# EAGLE design mapleCUx_med_024 (EAGLE 7.3.0)
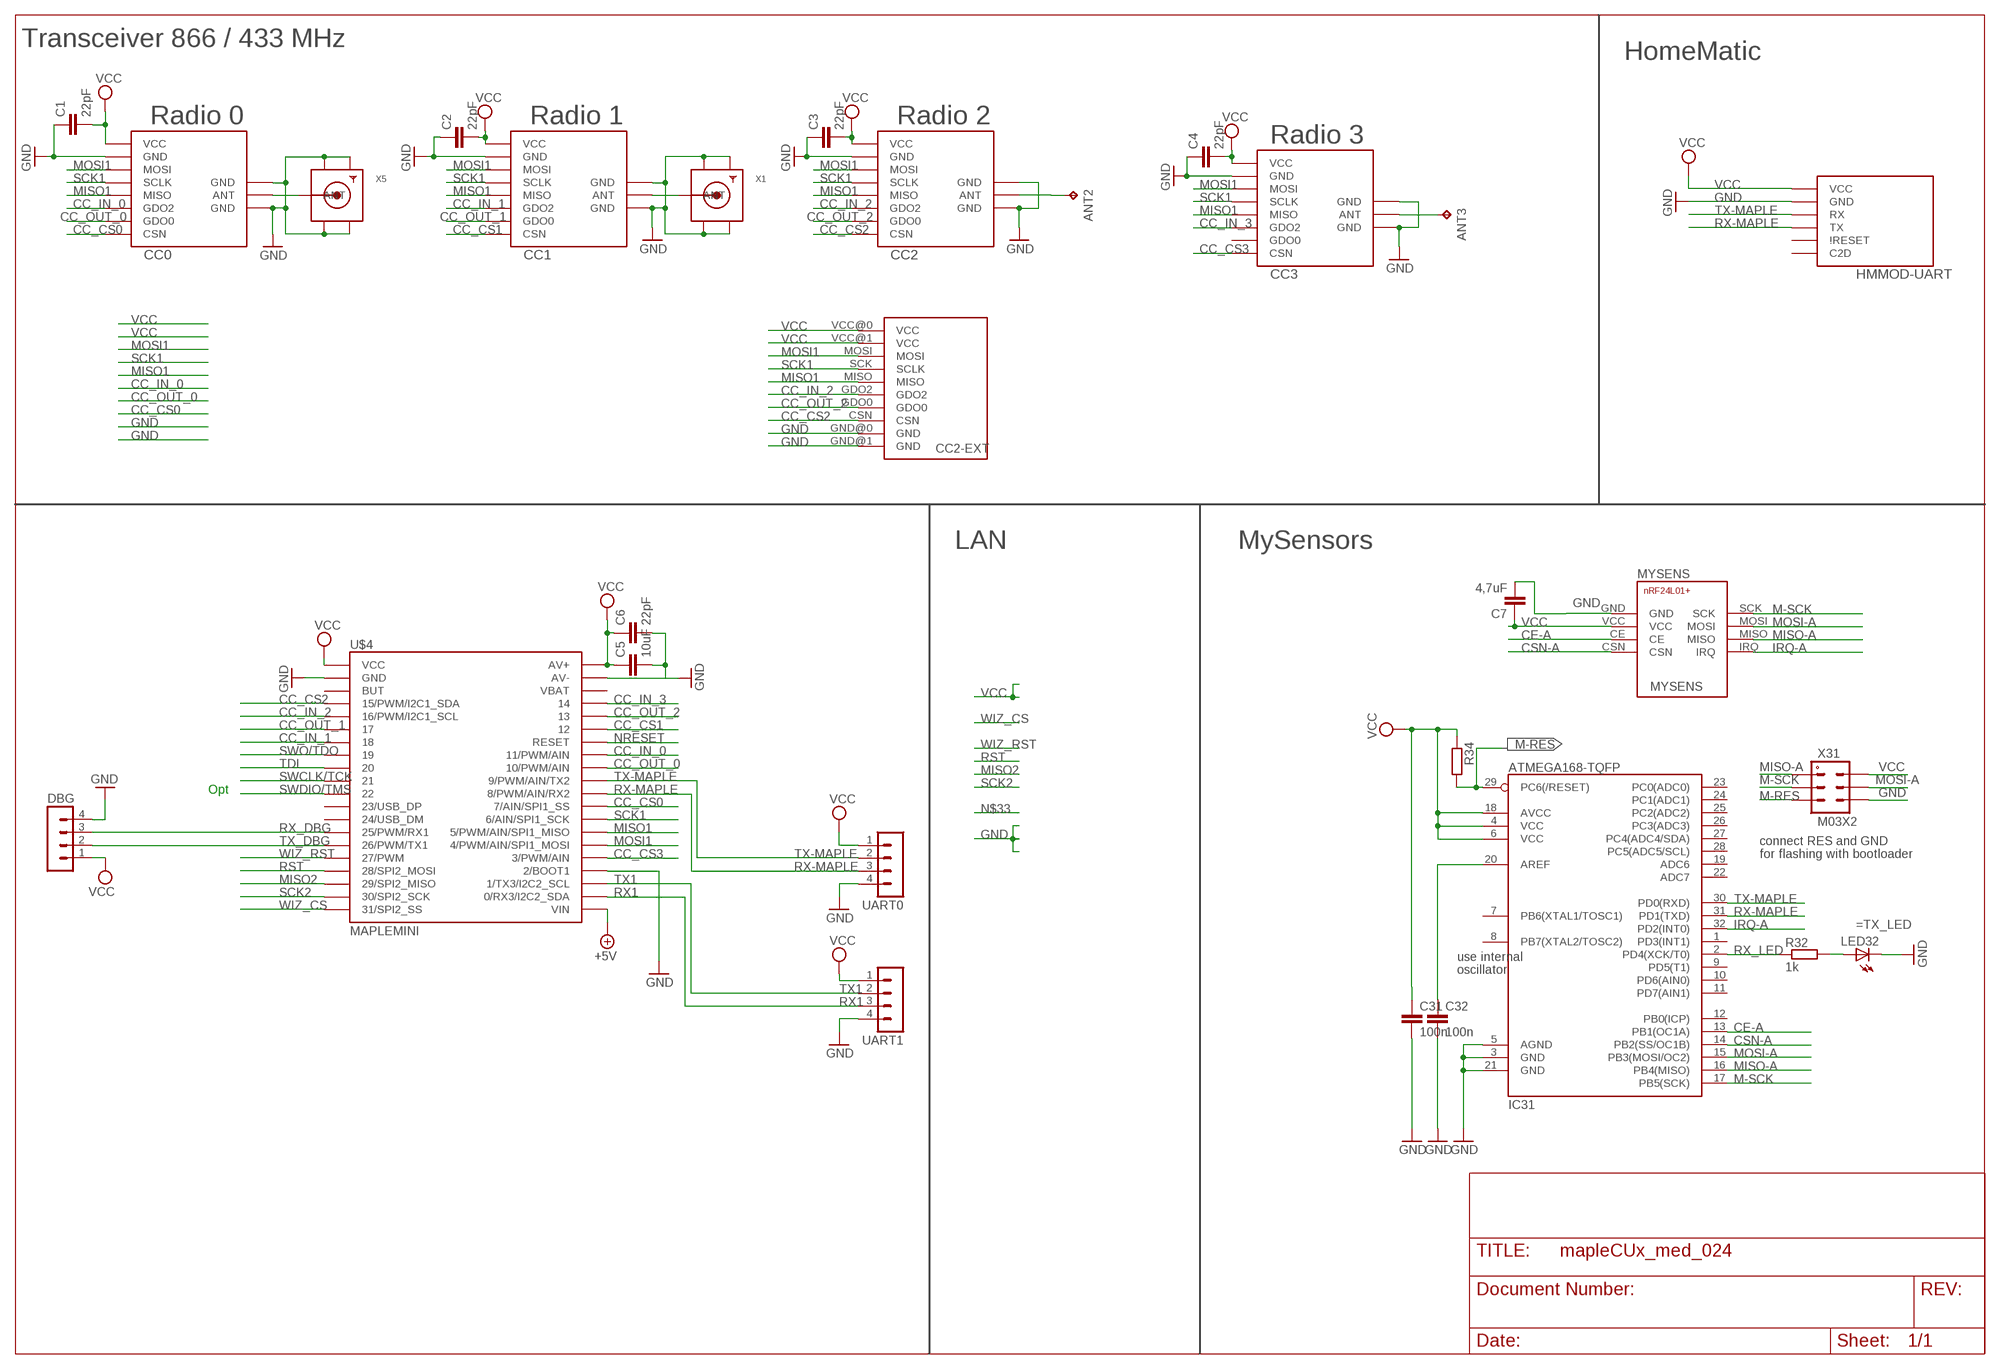
[diagram p0: schematic, sheet 1]

## Parts
ANT2  TPPAD1-13  [P1-13]
ANT3  TPPAD1-13  [P1-13]
C1  22pF  C-EUC0805  [C0805]
C2  22pF  C-EUC0805  [C0805]
C3  22pF  C-EUC0805  [C0805]
C4  22pF  C-EUC0805  [C0805]
C5  10uF  C-EUC1210  [C1210]
C6  22pF  C-EUC0805  [C0805]
C7  4,7uF  C-EUC1210  [C1210]
C31  100n  C-EUC0805  [C0805]
C32  100n  C-EUC0805  [C0805]
CC0  CC1101  CC1101_MODULE1SMD  [CC1101_MODULE1_SMD]
CC1  CC1101_MODULE1SMD  [CC1101_MODULE1_SMD]
CC2  CC1101_MODULE1SMD  [CC1101_MODULE1_SMD]
CC2-EXT  CC1101_MODULE3_DIL  [CC1101_MODULE3_DIL]
CC3  CC1101_MODULE1SMD  [CC1101_MODULE1_SMD]
DBG  MA04-1  [MA04-1]
HMMOD-UART  HM-MOD-UARTDIL  [HM-MOD-UART-DIL]
IC31  ATMEGA168-TQFP  [TQFP32-08]
LED32  LEDCHIPLED_0805  [CHIPLED_0805]
MYSENS  NRF24L01+SMD  [NRF24L01+SMD]
R32  1k  R-EU_R0805  [R0805]
R34  R-EU_R0805  [R0805]
U$4  MAPLEMINI  [20-DIP]
UART0  MA04-1  [MA04-1]
UART1  MA04-1  [MA04-1]
X1  SMACONNECTOR_EDGE_UFL  [SMA_EDGELAUNCH_UFL]
X5  SMACONNECTOR_EDGE_UFL  [SMA_EDGELAUNCH_UFL]
X31  M03X2  [2X03-1.27MM_SMD]

## Nets
+5V: U$4.21(VIN)
CC_CS0: CC0.CSN U$4.29(7/AIN/SPI1_SS)
CC_CS1: CC1.CSN U$4.35
CC_CS2: CC2-EXT.CSN CC2.CSN U$4.4(15/PWM/I2C1_SDA)
CC_CS3: CC3.CSN U$4.25(3/PWM/AIN)
CC_IN_0: CC0.GDO2 U$4.33(11/PWM/AIN)
CC_IN_1: CC1.GDO2 U$4.7
CC_IN_2: CC2-EXT.GDO2 CC2.GDO2 U$4.5(16/PWM/I2C1_SCL)
CC_IN_3: CC3.GDO2 U$4.37
CC_OUT_0: CC0.GDO0 U$4.32(10/PWM/AIN)
CC_OUT_1: CC1.GDO0 U$4.6
CC_OUT_2: CC2-EXT.GDO0 CC2.GDO0 U$4.36
CE-A: IC31.13(PB1(OC1A)) MYSENS.CE
CSN-A: IC31.14(PB2(SS/OC1B)) MYSENS.CSN
GND [PWR]: C1.1 C2.1 C3.1 C4.1 C5.2 C6.2 C7.2 C31.2 C32.2 CC0.GND@0(GND) CC0.GND@1(GND) CC0.GND@2(GND) CC1.GND@0(GND) CC1.GND@1(GND) CC1.GND@2(GND) CC2-EXT.GND@0(GND) CC2-EXT.GND@1(GND) CC2.GND@0(GND) CC2.GND@1(GND) CC2.GND@2(GND) CC3.GND@0(GND) CC3.GND@1(GND) CC3.GND@2(GND) DBG.4 HMMOD-UART.2(GND) IC31.3(GND) IC31.5(AGND) IC31.21(GND) LED32.C MYSENS.GND U$4.2(GND) U$4.24(2/BOOT1) U$4.39(AV-) UART0.4 UART1.4 X1.GND@1(GND1) X1.GND@2(GND2) X1.GND@3(GND3) X1.GND@4(GND4) X5.GND@1(GND1) X5.GND@2(GND2) X5.GND@3(GND3) X5.GND@4(GND4) X31.P$6
IRQ-A: IC31.32(PD2(INT0)) MYSENS.IRQ
M-RES: IC31.29(PC6(/RESET)) R34.2 X31.P$5
M-SCK: IC31.17(PB5(SCK)) MYSENS.SCK X31.P$3
MISO1: CC0.MISO CC1.MISO CC2-EXT.MISO CC2.MISO CC3.MISO U$4.27(5/PWM/AIN/SPI1_MISO)
MISO2: U$4.18(29/SPI2_MISO)
MISO-A: IC31.16(PB4(MISO)) MYSENS.MISO X31.P$1
MOSI1: CC0.MOSI CC1.MOSI CC2-EXT.MOSI CC2.MOSI CC3.MOSI U$4.26(4/PWM/AIN/SPI1_MOSI)
MOSI-A: IC31.15(PB3(MOSI/OC2)) MYSENS.MOSI X31.P$4
N$1: CC1.ANT X1.P(ANT)
N$2: ANT3.TP CC3.ANT
N$3: ANT2.TP CC2.ANT
N$4: CC0.ANT X5.P(ANT)
N$5: LED32.A R32.2
N$15: C32.1 IC31.20(AREF)
NRESET: U$4.34(RESET)
RST: U$4.17(28/SPI2_MOSI)
RX1: U$4.22(0/RX3/I2C2_SDA) UART1.3
RX-MAPLE: HMMOD-UART.5(TX) IC31.31(PD1(TXD)) U$4.30(8/PWM/AIN/RX2) UART0.3
RX_DBG: DBG.3 U$4.14(25/PWM/RX1)
RX_LED: IC31.2(PD4(XCK/T0)) R32.1
SCK1: CC0.SCLK CC1.SCLK CC2-EXT.SCK(SCLK) CC2.SCLK CC3.SCLK U$4.28(6/AIN/SPI1_SCK)
SCK2: U$4.19(30/SPI2_SCK)
SWCLK/TCK: U$4.10
SWDIO/TMS: U$4.11
SWO/TDO: U$4.8
TDI: U$4.9
TX1: U$4.23(1/TX3/I2C2_SCL) UART1.2
TX-MAPLE: HMMOD-UART.6(RX) IC31.30(PD0(RXD)) U$4.31(9/PWM/AIN/TX2) UART0.2
TX_DBG: DBG.2 U$4.15(26/PWM/TX1)
VCC [PWR]: C1.2 C2.2 C3.2 C4.2 C5.1 C6.1 C7.1 C31.1 CC0.VCC CC1.VCC CC2-EXT.VCC@0(VCC) CC2-EXT.VCC@1(VCC) CC2.VCC CC3.VCC DBG.1 HMMOD-UART.1(VCC) IC31.4(VCC) IC31.6(VCC) IC31.18(AVCC) MYSENS.VCC R34.1 U$4.1(VCC) U$4.40(AV+) UART0.1 UART1.1 X31.P$2
WIZ_CS: U$4.20(31/SPI2_SS)
WIZ_RST: U$4.16(27/PWM)
Unconnected: CC3.GDO0 HMMOD-UART.3(C2D) HMMOD-UART.4(\!RESET) IC31.1(PD3(INT1)) IC31.7(PB6(XTAL1/TOSC1)) IC31.8(PB7(XTAL2/TOSC2)) IC31.9(PD5(T1)) IC31.10(PD6(AIN0)) IC31.11(PD7(AIN1)) IC31.12(PB0(ICP)) IC31.19(ADC6) IC31.22(ADC7) IC31.23(PC0(ADC0)) IC31.24(PC1(ADC1)) IC31.25(PC2(ADC2)) IC31.26(PC3(ADC3)) IC31.27(PC4(ADC4/SDA)) IC31.28(PC5(ADC5/SCL)) U$4.3(BUT) U$4.12(23/USB_DP) U$4.13(24/USB_DM) U$4.38(VBAT)

## Notes on the sheet
- Transceiver 866 / 433 MHz
- HomeMatic
- Radio 0 | Radio 1 | Radio 2
- Radio 3
- LAN | MySensors
- Opt
- connect RES and GND
- for flashing with bootloader
- =TX_LED
- use internal
- oscillator

## Library data of the parts
ANT2 ANT3 = testpad:TP: Test pad
C1-C7 C31 C32 = rcl:C-EU: CAPACITOR, European symbol
CC0 CC1-CC3 = wireless:CC1101_MODULE1: CC1101 wireless module for 433/868 MHz (sold from Aliexpress). DIL version for mounting with pin header (and SMD soldering) and SMD only variant available.
CC2-EXT = wireless:CC1101_MODULE3_DIL: 433 Mhz CC1101 wireless module named RF1101SE V3.1 package special has only limited silk screen on tPlace layer
DBG UART0 UART1 = con-lstb:MA04-1: PIN HEADER; OC_FARNELL: unknown; OC_NEWARK: unknown
HMMOD-UART = wireless:HM-MOD-UART: eQ3 HM-MOD-UART-AW-SH2 wireless module for 868 MHz. DIL version for mounting with pin header (antenna upwards) and SMD variant available (antenna downwards).
IC31 = atmel:ATMEGA168: Atmel Atmega 168/328/328P
LED32 = led:LED: LED OSRAM: - CHIPLED LG R971, LG N971, LY N971, LG Q971, LY Q971, LO R971, LY R971 LH N974, LH R974 LS Q976, LO Q976, LY Q976 LO Q996 - Hyper CHIPLED LW Q18S LB Q993, LB Q99A, LB R99A - SideLED LS A670, LO A670, LY A670, LG A670, LP A670 LB A673, LV A673, LT A673, LW A673 LH A674 LY A675 LS A676, LA A676, LO A676, LY A676, LW A676 LS A679, LY A679, LG A679 - Hyper Micro SIDELED® LS Y876, LA Y876, LO Y876, LY Y876 LT Y87S - SmartLED LW L88C, LW L88S LB L89C, LB L89S, LG L890 LS L89K, LO L89K, LY L89K LS L896, LA L896, LO L896, LY L896 - TOPLED LS T670, LO T670, LY T670, LG T670, LP T670 LSG T670, LSP T670, LSY T670, LOP T670, LYG T670 LG T671, LOG T671, LSG T671 LB T673, LV T673, LT T673, LW T673 LH T674 LS T676, LA T676, LO T676, LY T676, LB T676, LH T676, LSB T676, LW T676 LB T67C, LV T67C, LT T67C, LS T67K, LO T67K, LY T67K, LW E67C LS E67B, LA E67B, LO E67B, LY E67B, LB E67C, LV E67C, LT E67C LW T67C LS T679, LY T679, LG T679 LS T770, LO T770, LY T770, LG T770, LP T770 LB T773, LV T773, LT T773, LW T773 LH T774 LS E675, LA E675, LY E675, LS T675 LS T776, LA T776, LO T776, LY T776, LB T776 LHGB T686 LT T68C, LB T68C - Hyper Mini TOPLED® LB M676 - Mini TOPLED Santana® LG M470 LS M47K, LO M47K, LY M47K Source: http://www.osram.convergy.de LUXEON: - LUMILED® LXK2-PW12-R00, LXK2-PW12-S00, LXK2-PW14-U00, LXK2-PW14-V00 LXK2-PM12-R00, LXK2-PM12-S00, LXK2-PM14-U00 LXK2-PE12-Q00, LXK2-PE12-R00, LXK2-PE12-S00, LXK2-PE14-T00, LXK2-PE14-U00 LXK2-PB12-K00, LXK2-PB12-L00, LXK2-PB12-M00, LXK2-PB14-N00, LXK2-PB14-P00, LXK2-PB14-Q00 LXK2-PR12-L00, LXK2-PR12-M00, LXK2-PR14-Q00, LXK2-PR14-R00 LXK2-PD12-Q00, LXK2-PD12-R00, LXK2-PD12-S00 LXK2-PH12-R00, LXK2-PH12-S00 LXK2-PL12-P00, LXK2-PL12-Q00, LXK2-PL12-R00 Source: www.luxeon.com KINGBRIGHT: KA-3528ASYC Source: www.kingbright.com
MYSENS = wireless:NRF24L01+: nRF24L01+ Transceiver Module
R32 R34 = rcl:R-EU_: RESISTOR, European symbol
U$4 = maplemini-mall:MAPLEMINI
X1 X5 = adafruit:SMACONNECTOR: SMA Connector 90° DIP SMA Connector, 50 Ohm (4UConnector: 07259)
X31 = mechanics:M03X2

## Net classes
0 default: width 0.305 mm
1 PWR: width 0.457 mm

## Board
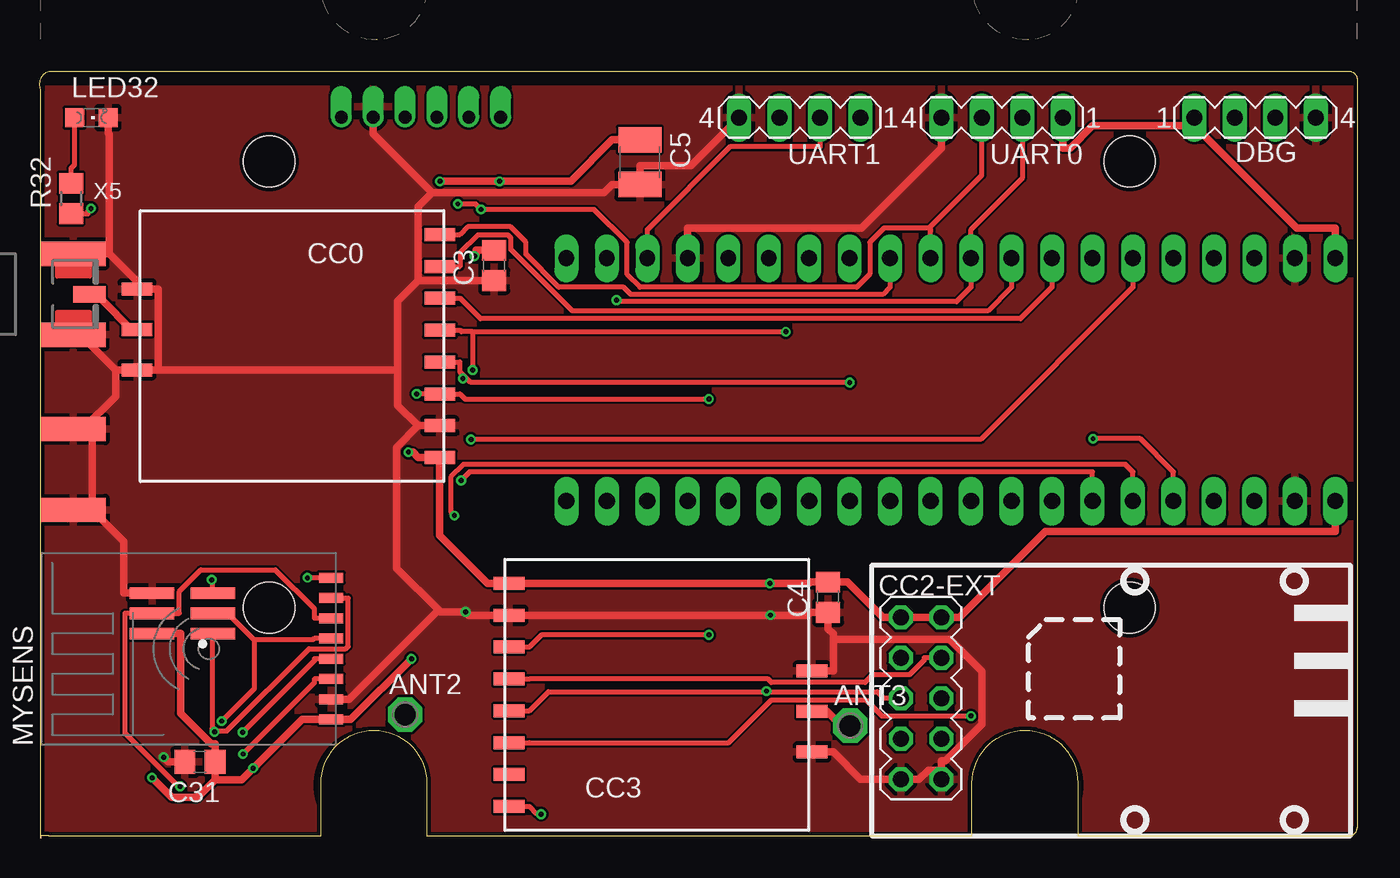
[diagram p1: board, top side]
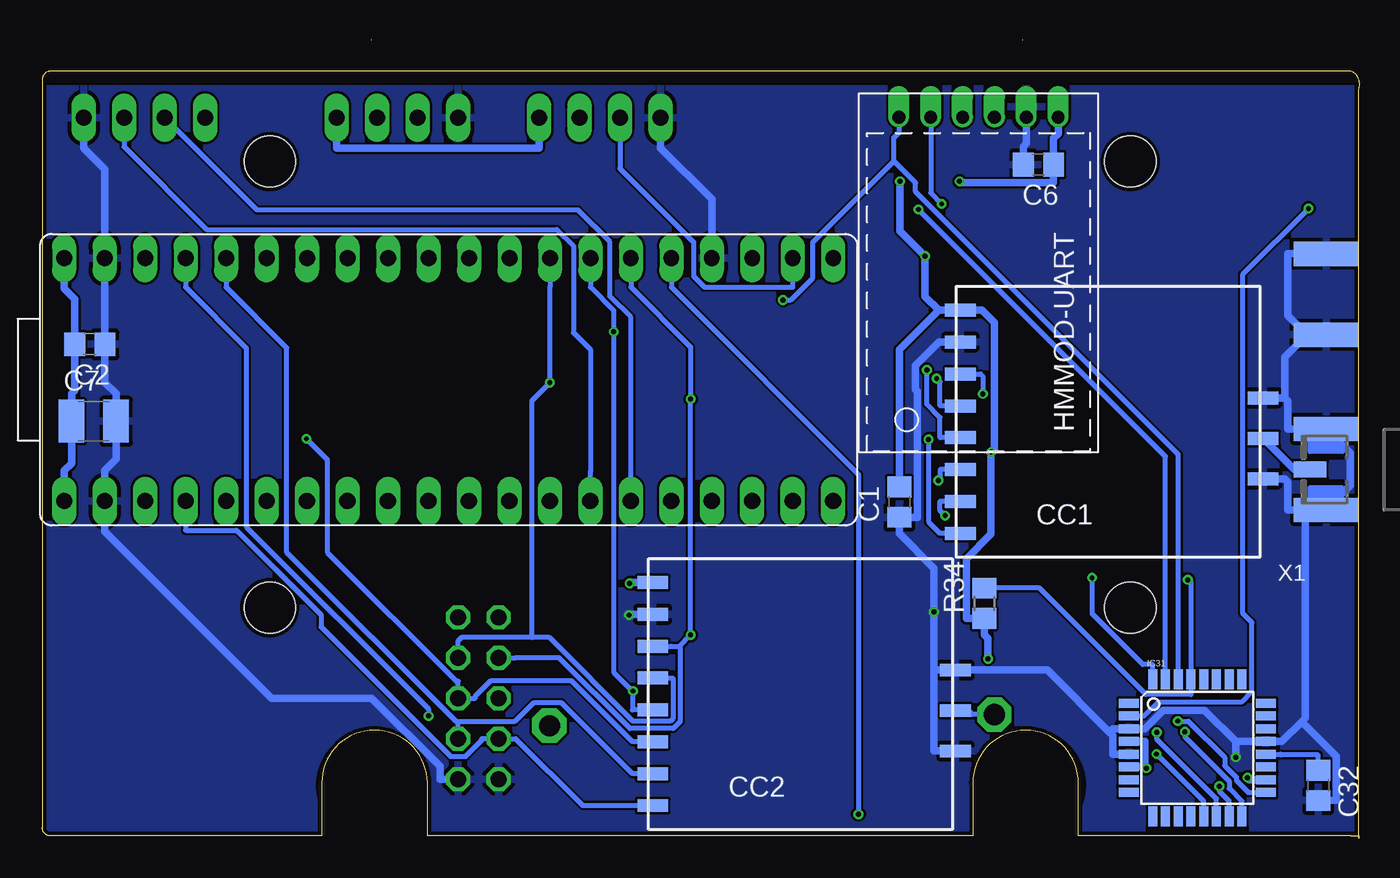
[diagram p2: board, bottom side, seen from below]

Size 82.66 x 50.1 mm. Coordinates in mm from the lower left corner, seen from the top.
Outline: 61.8,6.76 arc90 58.5,3.46 58.5,0.14 24.27,0.14 24.27,3.46 arc90 20.97,6.76 20.94,6.76 arc90 17.64,3.46 17.64,0.14 0.56,0.14 0.06,0.14 0.06,0 0.06,47 arc-90 0.56,48.13 82.16,48.13 arc-90 82.66,47.63 82.66,0.64 arc-90 82.16,0.14 65.13,0.14 65.13,3.46 arc90 61.83,6.76
Outline: 21.17,50.1 21.14,50.1
Outline: 62.03,50.1 62,50.1
Copper layers (1*16): Top 0.035mm / dielectric 1.5mm / Bottom 0.035mm
Design rules "SeeedStudio_2layer_DRU_no_angle_20140221": minimum track width 6mil, minimum drill 12mil, track to track 6mil, track to pad 6mil, pad to pad 6mil, via to via 6mil, smd to smd 0mil, copper to edge 10mil, drill to drill 10mil, minimum pad ring 10mil, minimum via ring 6mil, stop-mask expansion 2mil, vias tented up to drill 100mil, thermal gap 10mil
Holes 3.2 mm at 14.39,14.46 14.39,42.46 68.39,42.46 68.39,14.46
tRestrict: area 17.3,-0.1 to 24.2,6.7; area 58.5,-0.1 to 65.3,6.7; 1 lines
bRestrict: area 17.3,-0.1 to 24.2,6.7; area 58.5,-0.1 to 65.3,6.7; 1 lines

### Footprints (pad centres in the part's own frame; a part is rotated, then mirrored left to right if it is on the bottom)
P1-13 = drill 1.321 pad 2.159 octagon: TP 0,0
C0805 = smd 1.3 x 1.5: 1 -0.95,0; 2 0.95,0
C1210 = smd 1.6 x 2.7: 1 -1.4,0; 2 1.4,0
CC1101_MODULE1_SMD = smd 1.93 x 0.813: ANT 19,5.96; CSN 0,0; GDO0 0,2; GDO2 0,4; GND@0 0,12; GND@1 19,8.5; GND@2 19,3.42; MISO 0,6; MOSI 0,10; SCLK 0,8; VCC 0,14
CC1101_MODULE3_DIL = drill 1.016 octagon: CSN 1.81,6.1; GDO0 4.35,6.1; GDO2 4.35,8.64; GND@0 1.81,3.56; GND@1 4.35,3.56; MISO 1.81,8.64; MOSI 1.81,11.18; SCK 4.35,11.18; VCC@0 1.81,13.72; VCC@1 4.35,13.72
MA04-1 = drill 1.016 long: 1 -3.81,0; 2 -1.27,0; 3 1.27,0; 4 3.81,0
HM-MOD-UART-DIL = drill 0.8 offset: 1 0,12; 2 0,10; 3 0,8; 4 0,6; 5 0,4; 6 0,2
TQFP32-08 = smd 1.27 x 0.559: 1 -4.293,2.8; 2 -4.293,2; 3 -4.293,1.2; 4 -4.293,0.4; 5 -4.293,-0.4; 6 -4.293,-1.2; 7 -4.293,-2; 8 -4.293,-2.8; 17 4.293,-2.8; 18 4.293,-2; 19 4.293,-1.2; 20 4.293,-0.4; 21 4.293,0.4; 22 4.293,1.2; 23 4.293,2; 24 4.293,2.8 | smd 0.559 x 1.27: 9 -2.8,-4.293; 10 -2,-4.293; 11 -1.2,-4.293; 12 -0.4,-4.293; 13 0.4,-4.293; 14 1.2,-4.293; 15 2,-4.293; 16 2.8,-4.293; 25 2.8,4.293; 26 2,4.293; 27 1.2,4.293; 28 0.4,4.293; 29 -0.4,4.293; 30 -1.2,4.293; 31 -2,4.293; 32 -2.8,4.293
CHIPLED_0805 = smd 1.2 x 1.2: A 0,-1.05; C 0,1.05
NRF24L01+SMD = smd 0.635 x 1.524: CE -1.575,-7.861; CSN -0.305,-7.861; GND -2.845,-7.861; IRQ 4.775,-7.861; MISO 3.505,-7.861; MOSI 2.235,-7.861; SCK 0.965,-7.861; VCC -4.115,-7.861
R0805 = smd 1.3 x 1.5: 1 -0.95,0; 2 0.95,0
20-DIP = drill 1.016 pad 1.27 long: 1 -24.13,-7.62; 2 -21.59,-7.62; 3 -19.05,-7.62; 4 -16.51,-7.62; 5 -13.97,-7.62; 6 -11.43,-7.62; 7 -8.89,-7.62; 8 -6.35,-7.62; 9 -3.81,-7.62; 10 -1.27,-7.62; 11 1.27,-7.62; 12 3.81,-7.62; 13 6.35,-7.62; 14 8.89,-7.62; 15 11.43,-7.62; 16 13.97,-7.62; 17 16.51,-7.62; 18 19.05,-7.62; 19 21.59,-7.62; 20 24.13,-7.62 | drill 1 pad 1.27 long: 21 24.13,7.62; 22 21.59,7.62; 23 19.05,7.62; 24 16.51,7.62; 25 13.97,7.62; 26 11.43,7.62; 27 8.89,7.62; 28 6.35,7.62; 29 3.81,7.62; 30 1.27,7.62; 31 -1.27,7.62; 32 -3.81,7.62; 33 -6.35,7.62; 34 -8.89,7.62; 35 -11.43,7.62; 36 -13.97,7.62; 37 -16.51,7.62; 38 -19.05,7.62; 39 -21.59,7.62; 40 -24.13,7.62
SMA_EDGELAUNCH_UFL = smd 4.064 x 1.524: GND@1 2.032,-2.54; GND@2 2.032,2.54 | smd 4.064 x 1.524 bottom: GND@3 2.032,2.54; GND@4 2.032,-2.54 | smd 2.032 x 1.016: P 3.048,0
2X03-1.27MM_SMD = smd 0.75 x 2.8: P$1 -1.27,-1.905; P$2 -1.27,1.905; P$3 0,-1.905; P$4 0,1.905; P$5 1.27,-1.905; P$6 1.27,1.905

### Placement (x,y rotation side)
ANT2  22.92,7.75 0 top
ANT3  50.84,7.06 0 top
C1  28.89,21.09 90 bottom
C2  79.69,31 180 bottom
C3  28.51,35.95 90 top
C4  49.46,15.12 90 top
C5  37.65,42.43 270 top
C6  20.16,42.28 180 bottom
C7  79.43,26.17 0 bottom
C31  10.05,4.79 180 top
C32  2.6,3.31 270 bottom
CC0  25.09,37.88 180 top
CC1  25.06,19.14 0 bottom
CC2  44.36,2.04 0 bottom
CC2-EXT  52.22,0.14 0 top
CC3  29.45,1.99 0 top
DBG  76.26,45.22 0 top
HMMOD-UART  30.92,45.25 270 bottom
IC31  10.19,5.67 0 bottom
LED32  3.23,45.22 270 top
MYSENS  10.42,11.56 90 top
R32  1.96,40.14 90 top
R34  23.55,14.74 90 bottom
U$4  57.17,28.78 0 bottom
UART0  60.38,45.22 180 top
UART1  47.68,45.22 180 top
X1  0.06,23.14 180 bottom
X5  0.06,34.13 0 top
X31  8.95,14.11 90 top

### Tracks (layer width: path | path; a pad name or v marks a point on that pad's centre or on a via)
CC_CS0
  Top 0.305: CC0.CSN 26.36,37.88 26.85,38.37 29.53,38.37 30.5,37.4 30.5,36.64 32.56,34.58 36.64,34.58 37.1,34.12 52.9,34.12 53.36,34.58 U$4.29
CC_CS1  (via drill 0.3 pad 0.61)
  Top 0.305: U$4.35 68.6,34.58 59.04,25.02 v27.05,25.02
  Bottom 0.305: CC1.CSN 26.33,19.14 27.05,19.86 v27.05,25.02
CC_CS2
  Bottom 0.305: U$4.4 73.68,19.33 70.48,19.33 65.17,14.02 65.17,13.25 57.05,5.12 56.1,5.12 55.1,6.12 55.1,6.23 CC2-EXT.CSN 52.97,6.23 48.78,2.04 CC2.CSN
CC_CS3  (via drill 0.3 pad 0.61)
  Top 0.305: CC3.CSN 30.72,1.99 31.21,1.5 v31.45,1.5
  Bottom 0.305: U$4.25 43.2,34.58 31.45,22.84 v31.45,1.5
CC_IN_0
  Top 0.305: CC0.GDO2 26.36,33.88 27.65,32.6 61.53,32.6 63.52,34.58 U$4.33
CC_IN_1  (via drill 0.3 pad 0.61)
  Top 0.305: v26.43,22.45 26.97,22.98 66.06,22.98 U$4.7
  Bottom 0.305: v26.43,22.45 26.33,22.56 26.33,23.14 CC1.GDO2
CC_IN_2  (via drill 0.3 pad 0.61)
  Top 0.305: U$4.5 71.14,22.98 69.05,25.07 v66.1,25.07
  Bottom 0.305: v66.1,25.07 64.79,23.76 64.79,17.94 56.69,9.84 56.57,9.84 CC2-EXT.GDO2 55.51,8.78 55.51,8.91 54.55,9.86 49.45,9.86 45.63,6.04 CC2.GDO2
CC_IN_3  (via drill 0.3 pad 0.61)
  Top 0.305: v58.43,7.67 52.84,7.67 51.83,8.68 45.91,8.68 43.23,5.99 30.72,5.99 CC3.GDO2
  Bottom 0.305: v58.43,7.67 58.43,8.11 69.87,19.55 69.87,30.77 73.68,34.58 U$4.37
CC_OUT_0
  Top 0.305: CC0.GDO0 26.36,35.88 26.36,36.74 27.49,37.86 29.38,37.86 29.56,37.67 29.56,36.94 33.42,33.08 59.48,33.08 60.98,34.58 U$4.32
CC_OUT_1  (via drill 0.3 pad 0.61)
  Top 0.305: v26.01,20.24 25.78,20.47 25.78,22.66 26.58,23.46 68.12,23.46 68.6,22.98 U$4.6
  Bottom 0.305: v26.01,20.24 26.33,20.56 26.33,21.14 CC1.GDO0
CC_OUT_2
  Bottom 0.305: 56.57,7.3 53.03,7.3 51.85,8.48 50.07,8.48 45.63,4.04 CC2.GDO0 | 56.57,7.3 56.69,7.3 67.33,17.94 67.33,30.77 71.14,34.58 U$4.36 | CC2-EXT.GDO0 56.57,7.3
CE-A  (via drill 0.3 pad 0.61)
  Top 0.305: v12.75,5.28 17.21,9.74 17.21,9.99 MYSENS.CE
  Bottom 0.305: v12.75,5.28 9.79,2.32 IC31.13
CSN-A  (via drill 0.3 pad 0.61)
  Top 0.305: MYSENS.CSN 17.21,11.26 17.21,11.12 v12.73,6.63
  Bottom 0.305: IC31.14 8.99,2.47 12.73,6.21 v12.73,6.63
GND  (via drill 0.3 pad 0.61)
  Top 0.457: v7.77,5.08 8.07,4.79 C31.2 | 23.74,35 23.74,39.64 24.61,40.52 | 22.47,29.39 22.47,33.72 23.74,35 | 23.74,35 27.38,35 C3.1 | 24.61,40.52 35.41,40.52 35.92,41.03 C5.2 37.65,42.21 40.86,42.21 UART1.4 | 24.61,40.52 20.92,44.22 HMMOD-UART.2 | 22.47,29.39 7.44,29.39 | 23.75,25.89 22.47,27.17 22.47,29.39 | 56.57,4.27 55.75,4.27 55.18,3.7 CC2-EXT.GND@0 51.51,3.7 49.79,5.41 CC3.GND@2 | 56.57,4.27 56.57,4.84 56.81,4.84 59.12,7.14 59.12,10.46 57.09,12.48 49.79,12.48 | CC2-EXT.GND@1 56.57,4.27 | 49.79,12.48 49.79,12.81 49.46,13.14 C4.1 48.33,14.17 48.15,13.99 v45.85,13.99 CC3.GND@0 28.1,13.99 26.92,13.99 v26.71,14.2 25.13,14.2 25.01,14.31 | 49.79,12.48 49.79,10.49 CC3.GND@1 | 25.01,14.31 19.42,8.72 MYSENS.GND | UART0.4 56.57,43.31 51.54,38.28 40.66,38.28 U$4.24 | X5.GND@1 2.54,31.6 4.75,29.39 | 7.44,29.39 7.44,34.46 CC0.GND@2 6.09,34.93 4.35,36.67 | 4.75,29.39 CC0.GND@1 7.44,29.39 | 2.69,25.68 4.75,27.73 4.75,29.39 | 2.69,25.68 3.3,25.68 3.3,20.6 | X1.GND@1 2.69,25.68 | LED32.C 4.28,44.24 4.35,44.17 4.35,36.67 | 23.75,25.89 22.39,24.53 22.39,16.93 25.01,14.31 | CC0.GND@0 23.75,25.89 | X31.P$6 5.26,15.38 5.26,18.63 3.3,20.6 | X5.GND@2 4.35,36.67 | X1.GND@2 3.3,20.6
  Bottom 0.457: 7.77,6.07 IC31.21 5.39,6.07 4.88,6.07 3.64,7.31 | 7.77,6.07 9.73,8.03 12.31,8.03 13.47,6.87 IC31.3 15.5,6.87 15.72,6.65 | 7.77,6.07 v7.77,5.08 | 15.72,6.65 19.61,10.54 CC2.GND@1 26.71,10.54 | 15.72,6.65 15.5,6.44 15.5,5.27 IC31.5 | C6.2 21.11,43.41 20.92,43.6 HMMOD-UART.2 | 26.71,10.54 | 26.71,10.54 v26.71,14.2 26.71,16.93 28.89,19.11 C1.1 27.76,20.14 27.76,28.03 27.88,28.15 27.88,29.66 26.41,31.14 CC1.GND@0 | UART1.4 43.87,43.31 40.66,40.1 U$4.24 | 26.71,10.54 26.71,5.46 CC2.GND@2 | 3.3,31.6 4.71,30.18 4.71,27.64 | 3.3,31.6 4.5,32.8 4.5,36.67 X5.GND@2 | CC1.GND@1 4.71,27.64 | 4.71,27.64 4.5,27.43 4.5,25.68 X1.GND@1 0.58,24.16 0.58,22.13 2.11,20.6 2.32,20.6 | v45.85,13.99 45.8,14.04 45.71,14.04 CC2.GND@0 | X5.GND@1 3.3,31.6 | 3.41,20.6 3.41,7.54 3.64,7.31 | 3.64,7.31 1.47,5.14 1.47,2.36 C32.2 | CC2-EXT.GND@1 57.72,3.7 57.72,4.5 61.99,8.77 68.28,8.77 78.76,19.25 U$4.2 78.76,21.45 78.76,23.06 78.03,23.78 C7.2 78.03,27.9 78.74,28.61 C2.1 78.74,34.49 78.76,34.51 U$4.39 78.76,42 80.07,43.31 DBG.4 | 3.41,20.6 4.5,20.6 4.5,22.35 4.71,22.56 CC1.GND@2 | 2.32,20.6 3.41,20.6 | X1.GND@2 2.32,20.6
  pour Bottom: -1.21,-0.5 -1.21,49.66 83.88,49.66 83.88,-0.5
  pour Top: 0.06,0.14 0.06,47.76 86.42,47.76 86.42,0.14
IRQ-A  (via drill 0.3 pad 0.61)
  Top 0.305: MYSENS.IRQ v16.79,16.34
  Bottom 0.305: IC31.32 12.99,10.9 13.61,10.9 16.79,14.08 v16.79,16.34
M-RES  (via drill 0.3 pad 0.61)
  Top 0.305: X31.P$5 10.85,16.14 v10.78,16.22
  Bottom 0.305: R34.2 20.09,15.69 13.43,9.02 10.59,9.02 IC31.29 10.59,16.02 v10.78,16.22
M-SCK  (via drill 0.3 pad 0.61)
  Top 0.305: 13.45,12.45 11.8,14.11 X31.P$3 | 13.45,12.45 17.13,12.45 17.21,12.53 MYSENS.SCK | 13.45,12.45 13.45,9.38 v11.42,7.34
  Bottom 0.305: v11.42,7.34 10.75,7.34 8.46,5.06 8.46,4.55 7.73,3.82 7.73,3.61 6.99,2.87 IC31.17
MISO1  (via drill 0.3 pad 0.61)
  Top 0.305: 27.16,31.79 v46.81,31.79 | 27.16,31.79 v27.16,29.38 | 27.16,31.79 26.46,31.79 26.36,31.89 CC0.MISO | 45.6,9.18 52.56,9.18 52.97,8.78 CC2-EXT.MISO | 45.6,9.18 31.91,9.18 30.72,7.99 CC3.MISO | 45.6,9.18 v45.6,9.23
  Bottom 0.305: 45.63,9.23 46.81,10.4 v46.81,31.79 46.81,33.12 48.28,34.58 U$4.27 | v27.16,29.38 27.16,27.24 26.33,26.41 26.33,25.14 CC1.MISO | v45.6,9.23 45.63,9.23 | 45.63,9.23 45.63,8.04 CC2.MISO
MISO-A  (via drill 0.3 pad 0.61)
  Top 0.305: 10.96,6.72 11.73,6.72 16.9,11.88 19.2,11.88 19.35,12.03 19.35,15.07 MYSENS.MISO | X31.P$1 10.8,12.78 10.8,6.88 10.96,6.72 | 10.96,6.72 v10.96,6.68
  Bottom 0.305: IC31.16 7.39,2.32 8.19,3.12 8.19,3.58 10.96,6.35 v10.96,6.68
MOSI1  (via drill 0.3 pad 0.61)
  Top 0.305: v41.98,27.56 26.69,27.56 26.36,27.89 CC0.MOSI 23.82,27.89 v23.65,27.89 | v41.98,12.75 31.48,12.75 30.72,11.99 CC3.MOSI
  Bottom 0.305: v23.65,27.89 23.65,28.99 23.79,29.14 CC1.MOSI | 42.68,12.04 v41.98,12.75 v41.98,27.56 41.98,30.83 45.74,34.58 U$4.26 | 42.68,12.04 43.21,12.04 CC2.MOSI | 42.68,12.04 42.64,12 42.64,7.3 43.06,6.88 45.79,6.88 50.23,11.31 52.97,11.31 | 52.97,11.31 | CC2-EXT.MOSI 52.97,11.31
MOSI-A  (via drill 0.3 pad 0.61)
  Top 0.305: v8.8,3.25 8.68,3.25 5.34,6.6 5.34,14.11 X31.P$4 7.52,14.11 8.75,14.11 8.75,15.48 10.11,16.84 14.78,16.84 17.21,14.41 17.21,13.8 MYSENS.MOSI
  Bottom 0.305: v8.8,3.25 8.8,2.93 8.19,2.32 IC31.15
N$1
  Bottom 0.457: X1.P 4.1,23.14 CC1.ANT
N$2
  Top 0.457: CC3.ANT 49.39,7.95 50.22,7.12 50.78,7.12 ANT3.TP
N$3
  Bottom 0.305: ANT2.TP 24.3,7.75 24.55,8.01 CC2.ANT
N$4
  Top 0.457: X5.P 3.87,34.13 3.87,33.79 5.77,31.89 6.05,31.89 CC0.ANT
N$5
  Top 0.305: R32.2 1.96,42.04 2.18,42.27 LED32.A
N$15
  Bottom 0.305: IC31.20 4.96,5.27 4.9,5.21 2.6,5.21 C32.1
RX1
  Bottom 0.305: U$4.22 35.58,34.58 41.11,34.58 41.8,35.27 41.8,37.41 46.41,42.03 UART1.3
RX-MAPLE  (via drill 0.3 pad 0.61)
  Top 0.305: v26.23,39.8 27.35,39.8 v27.69,39.46 34.79,39.46 36.85,37.41 36.85,35.38 37.65,34.58 51.26,34.58 52.09,35.41 52.09,37.41 52.98,38.3 55.8,38.3 | 55.8,38.3 55.9,38.21 55.9,38.09 U$4.30 | 55.8,38.3 59.11,41.61 UART0.3
  Bottom 0.305: v26.23,39.8 26.92,40.49 26.92,44.29 HMMOD-UART.5 | IC31.31 12.19,23.96 v27.69,39.46
RX_DBG
  Bottom 0.305: DBG.3 77.53,43.39 72.35,38.21 50.38,38.21 49.34,37.17 49.34,31.72 48.28,30.65 48.28,22.98 U$4.14
RX_LED  (via drill 0.3 pad 0.61)
  Top 0.305: R32.1 3.02,39.19 3.02,39.33 v3.21,39.52
  Bottom 0.305: v3.21,39.52 7.33,35.4 7.33,14.1 6.77,13.54 6.77,9.17 7.37,8.56 12.65,8.56 13.54,7.67 IC31.2
SCK1  (via drill 0.3 pad 0.61)
  Top 0.305: 26.66,28.97 26.36,29.26 26.36,29.89 CC0.SCLK | v50.82,28.6 27.03,28.6 26.66,28.97 | 26.66,28.97 v26.55,28.85 | CC3.SCLK 30.72,9.99 45.7,9.99 45.91,9.78 51.78,9.78 52.25,10.25 54.57,10.25 55.51,11.18 55.51,11.31 CC2-EXT.SCK
  Bottom 0.305: v26.55,28.85 26.33,28.63 26.33,27.14 CC1.SCLK | 51.93,12.58 51.93,27.48 v50.82,28.6 50.82,34.58 U$4.28 | 51.93,12.58 56.37,12.58 56.57,12.38 CC2-EXT.SCK | 51.93,12.58 50.85,12.58 45.6,7.33 43.25,7.33 43.09,7.49 43.09,10.04 CC2.SCLK
TX1
  Top 0.305: U$4.23 38.12,38.21 43.3,43.39 48.95,43.39 UART1.2
TX-MAPLE  (via drill 0.3 pad 0.61)
  Top 0.305: UART0.2 61.65,41.42 58.44,38.21 U$4.31 58.44,34.58 57.52,33.67 36.29,33.67 v36.18,33.77
  Bottom 0.305: 29.23,42.48 29.23,43.98 28.92,44.29 HMMOD-UART.6 | 29.23,42.48 27.87,41.13 27.87,40.57 11.39,24.09 11.39,10.9 IC31.30 | v36.18,33.77 35.69,33.77 34.31,35.16 34.31,37.41 29.23,42.48
TX_DBG
  Bottom 0.305: U$4.15 45.74,32.69 47.04,34 47.04,37.42 49.05,39.43 69.19,39.43 DBG.2
VCC  (via drill 0.3 pad 0.61)
  Top 0.457: v7.04,3.79 8.27,2.57 9.91,2.57 11,3.65 | 11,3.65 12.65,3.65 v13.39,4.39 16.45,7.45 17.14,7.45 MYSENS.VCC 18.85,7.45 19.51,7.45 v23.32,11.25 | 11,3.65 C31.1 11,5.92 10.76,5.92 8.83,7.85 8.83,12.83 X31.P$2 | v25.11,41.23 v28.85,41.23 33.32,41.23 35.92,43.83 C5.1 | v27.27,36.53 27.38,36.63 27.38,36.9 C3.2 | v23.13,24.23 23.41,24.23 23.75,23.89 CC0.VCC 25.09,19 28.1,15.99 CC3.VCC v45.81,15.99 48.25,15.99 48.33,16.07 C4.2 50.68,16.07 52.89,13.86 CC2-EXT.VCC@0 CC2-EXT.VCC@1 57.72,13.86 63.11,19.25 81.3,19.25 U$4.1 | U$4.40 81.3,38.28 78.87,38.28 72.45,44.71 | UART0.1 64.19,43.31 64.67,43.31 66.06,44.71 72.45,44.71 | DBG.1 72.45,44.71
  Bottom 0.457: v7.04,3.79 6.91,3.67 IC31.18 | 13.47,4.47 v13.39,4.39 | UART1.1 51.49,43.31 64.19,43.31 UART0.1 | v28.85,41.23 28.85,38.1 v27.27,36.53 27.27,34 26.41,33.13 | 26.41,33.13 28.89,30.65 28.89,23.07 C1.2 | v25.11,41.23 25.03,41.15 19.21,41.15 C6.1 19.21,43.93 18.92,44.22 HMMOD-UART.1 | IC31.4 13.47,6.07 13.47,4.47 | IC31.6 13.47,4.47 | v23.32,11.25 23.32,12.52 23.55,12.76 R34.1 24.69,13.79 24.69,17.54 23.13,19.1 v23.13,24.23 22.92,24.43 22.92,32.34 23.71,33.13 CC1.VCC 26.41,33.13 | v45.81,15.99 45.76,15.99 45.71,16.05 CC2.VCC | U$4.1 81.3,23.06 80.83,23.52 C7.1 80.83,27.9 80.64,28.1 C2.2 80.64,33.85 81.3,34.51 U$4.40